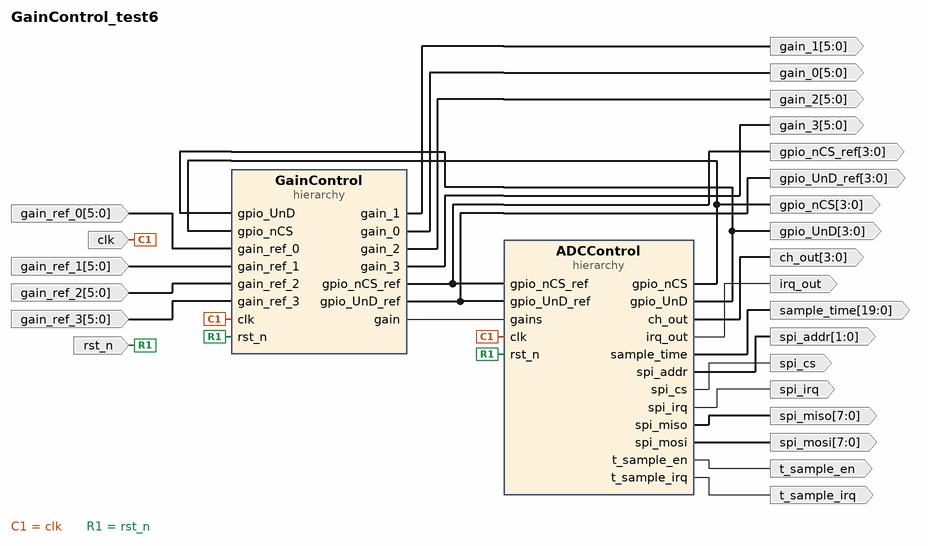
[diagram p0: block diagram of the top level]
# Vivado block design GainControl_test6, xczu3eg-sbva484-1-i, Vivado 2020.2
create_bd_design GainControl_test6

create_bd_port -dir O -from 3 -to 0 ch_out
create_bd_port -dir I -type clk clk
create_bd_port -dir O -from 5 -to 0 gain_0
create_bd_port -dir O -from 5 -to 0 gain_1
create_bd_port -dir O -from 5 -to 0 gain_2
create_bd_port -dir O -from 5 -to 0 gain_3
create_bd_port -dir I -from 5 -to 0 gain_ref_0
create_bd_port -dir I -from 5 -to 0 gain_ref_1
create_bd_port -dir I -from 5 -to 0 gain_ref_2
create_bd_port -dir I -from 5 -to 0 gain_ref_3
create_bd_port -dir O -from 3 -to 0 gpio_UnD
create_bd_port -dir O -from 3 -to 0 gpio_UnD_ref
create_bd_port -dir O -from 3 -to 0 gpio_nCS
create_bd_port -dir O -from 3 -to 0 gpio_nCS_ref
create_bd_port -dir O irq_out
create_bd_port -dir I -type rst rst_n
create_bd_port -dir O -from 19 -to 0 sample_time
create_bd_port -dir O -from 1 -to 0 spi_addr
create_bd_port -dir O spi_cs
create_bd_port -dir O spi_irq
create_bd_port -dir O -from 7 -to 0 spi_miso
create_bd_port -dir O -from 7 -to 0 -type data spi_mosi
create_bd_port -dir O t_sample_en
create_bd_port -dir O t_sample_irq

create_bd_cell -type hier ADCControl
create_bd_cell -type hier GainControl

# ---- hierarchy /ADCControl ----
current_bd_instance /ADCControl
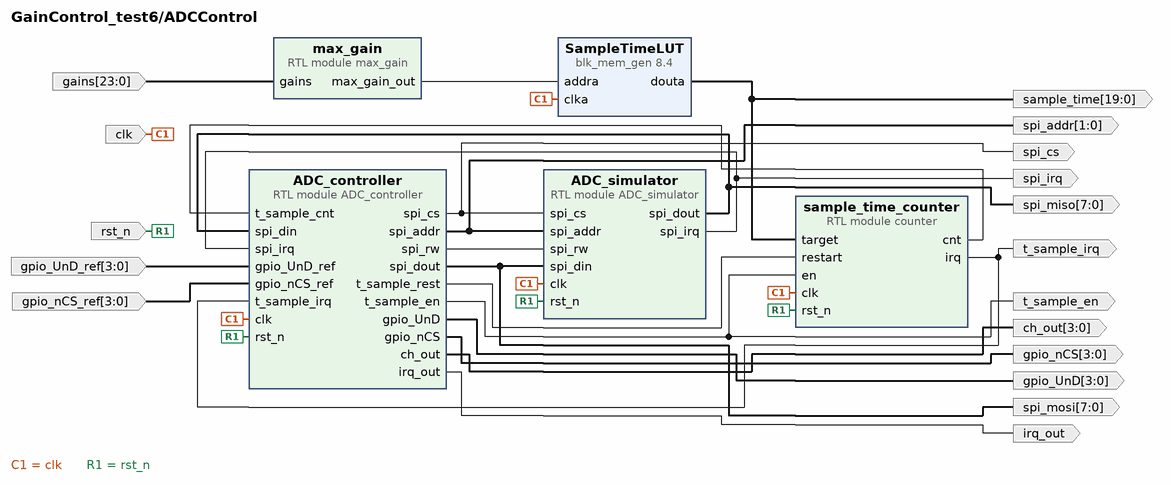
[diagram p1: block diagram inside /ADCControl]
create_bd_pin -dir I -type clk clk
create_bd_pin -dir I -type rst rst_n
create_bd_pin -dir O spi_cs
create_bd_pin -dir O -from 1 -to 0 spi_addr
create_bd_pin -dir O -from 7 -to 0 spi_mosi
create_bd_pin -dir O -from 7 -to 0 spi_miso
create_bd_pin -dir O spi_irq
create_bd_pin -dir O -from 3 -to 0 gpio_UnD
create_bd_pin -dir I -from 3 -to 0 gpio_UnD_ref
create_bd_pin -dir O -from 3 -to 0 gpio_nCS
create_bd_pin -dir I -from 3 -to 0 gpio_nCS_ref
create_bd_pin -dir O t_sample_en
create_bd_pin -dir O t_sample_irq
create_bd_pin -dir O -from 3 -to 0 ch_out
create_bd_pin -dir O irq_out
create_bd_pin -dir O -from 19 -to 0 sample_time
create_bd_pin -dir I -from 23 -to 0 gains

create_bd_cell -type module -reference ADC_controller ADC_controller
create_bd_cell -type module -reference ADC_simulator ADC_simulator
create_bd_cell -type module -reference counter sample_time_counter
set_property -dict {CONFIG.n_bits 20} [get_bd_cells sample_time_counter]
create_bd_cell -type module -reference max_gain max_gain
create_bd_cell -type ip -vlnv xilinx.com:ip:blk_mem_gen:8.4 SampleTimeLUT
set_property -dict [list \
  CONFIG.Coe_File ../../../../../../../../src/sample_time_lut_data.coe \
  CONFIG.Enable_32bit_Address false \
  CONFIG.Enable_A Always_Enabled \
  CONFIG.Fill_Remaining_Memory_Locations true \
  CONFIG.Load_Init_File true \
  CONFIG.Memory_Type Single_Port_ROM \
  CONFIG.Port_A_Write_Rate 0 \
  CONFIG.Register_PortA_Output_of_Memory_Primitives true \
  CONFIG.Remaining_Memory_Locations F \
  CONFIG.Use_RSTA_Pin false \
  CONFIG.Write_Depth_A 64 \
  CONFIG.Write_Width_A 20 \
  CONFIG.use_bram_block Stand_Alone \
] [get_bd_cells SampleTimeLUT]

# ---- hierarchy /GainControl ----
current_bd_instance /GainControl
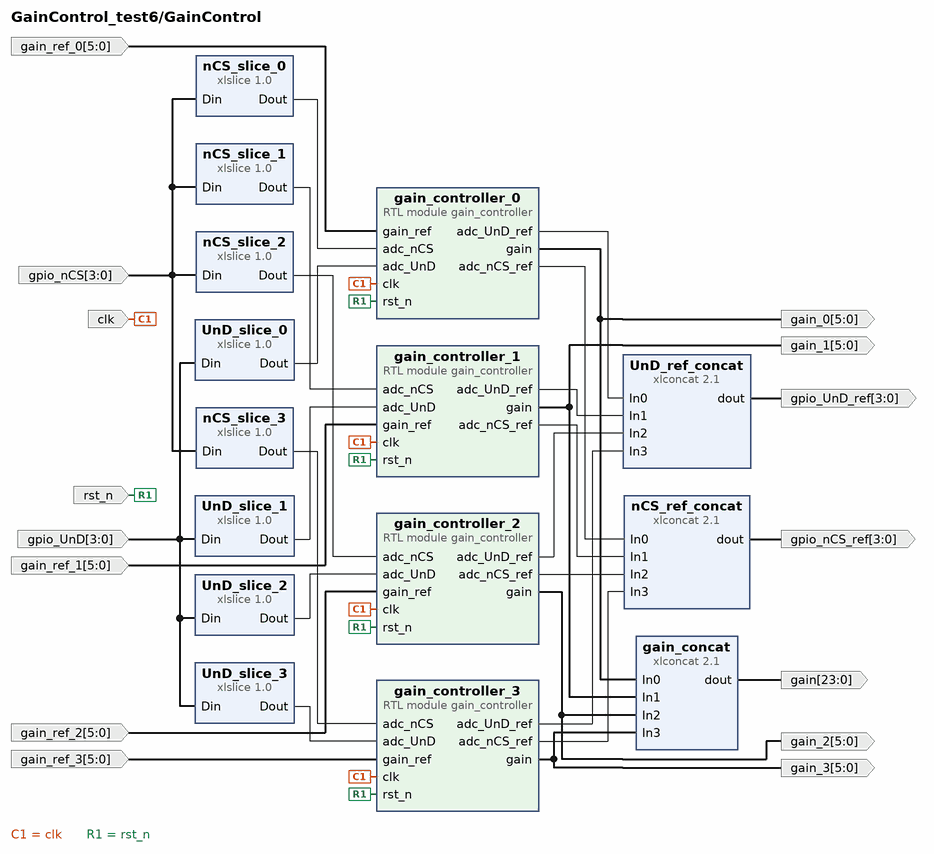
[diagram p2: block diagram inside /GainControl]
create_bd_pin -dir I -from 3 -to 0 gpio_nCS
create_bd_pin -dir I -from 3 -to 0 gpio_UnD
create_bd_pin -dir I -type clk clk
create_bd_pin -dir I -type rst rst_n
create_bd_pin -dir O -from 5 -to 0 gain_2
create_bd_pin -dir I -from 5 -to 0 gain_ref_2
create_bd_pin -dir O -from 5 -to 0 gain_3
create_bd_pin -dir I -from 5 -to 0 gain_ref_3
create_bd_pin -dir O -from 5 -to 0 gain_0
create_bd_pin -dir I -from 5 -to 0 gain_ref_0
create_bd_pin -dir O -from 5 -to 0 gain_1
create_bd_pin -dir I -from 5 -to 0 gain_ref_1
create_bd_pin -dir O -from 23 -to 0 gain
create_bd_pin -dir O -from 3 -to 0 gpio_nCS_ref
create_bd_pin -dir O -from 3 -to 0 gpio_UnD_ref

create_bd_cell -type ip -vlnv xilinx.com:ip:xlconcat:2.1 gain_concat
set_property -dict [list \
  CONFIG.IN0_WIDTH 6 \
  CONFIG.IN1_WIDTH 6 \
  CONFIG.IN2_WIDTH 6 \
  CONFIG.IN3_WIDTH 6 \
  CONFIG.NUM_PORTS 4 \
] [get_bd_cells gain_concat]
create_bd_cell -type ip -vlnv xilinx.com:ip:xlconcat:2.1 UnD_ref_concat
set_property -dict {CONFIG.NUM_PORTS 4} [get_bd_cells UnD_ref_concat]
create_bd_cell -type ip -vlnv xilinx.com:ip:xlconcat:2.1 nCS_ref_concat
set_property -dict {CONFIG.NUM_PORTS 4} [get_bd_cells nCS_ref_concat]
create_bd_cell -type ip -vlnv xilinx.com:ip:xlslice:1.0 UnD_slice_0
set_property -dict {CONFIG.DIN_WIDTH 4} [get_bd_cells UnD_slice_0]
create_bd_cell -type ip -vlnv xilinx.com:ip:xlslice:1.0 nCS_slice_0
set_property -dict {CONFIG.DIN_WIDTH 4} [get_bd_cells nCS_slice_0]
create_bd_cell -type module -reference gain_controller gain_controller_0
create_bd_cell -type ip -vlnv xilinx.com:ip:xlslice:1.0 UnD_slice_1
set_property -dict {CONFIG.DIN_FROM 1 CONFIG.DIN_TO 1 CONFIG.DIN_WIDTH 4 CONFIG.DOUT_WIDTH 1} [get_bd_cells UnD_slice_1]
create_bd_cell -type module -reference gain_controller gain_controller_1
create_bd_cell -type ip -vlnv xilinx.com:ip:xlslice:1.0 nCS_slice_1
set_property -dict {CONFIG.DIN_FROM 1 CONFIG.DIN_TO 1 CONFIG.DIN_WIDTH 4 CONFIG.DOUT_WIDTH 1} [get_bd_cells nCS_slice_1]
create_bd_cell -type ip -vlnv xilinx.com:ip:xlslice:1.0 UnD_slice_2
set_property -dict {CONFIG.DIN_FROM 2 CONFIG.DIN_TO 2 CONFIG.DIN_WIDTH 4 CONFIG.DOUT_WIDTH 1} [get_bd_cells UnD_slice_2]
create_bd_cell -type ip -vlnv xilinx.com:ip:xlslice:1.0 nCS_slice_2
set_property -dict {CONFIG.DIN_FROM 2 CONFIG.DIN_TO 2 CONFIG.DIN_WIDTH 4 CONFIG.DOUT_WIDTH 1} [get_bd_cells nCS_slice_2]
create_bd_cell -type module -reference gain_controller gain_controller_2
create_bd_cell -type ip -vlnv xilinx.com:ip:xlslice:1.0 UnD_slice_3
set_property -dict {CONFIG.DIN_FROM 3 CONFIG.DIN_TO 3 CONFIG.DIN_WIDTH 4 CONFIG.DOUT_WIDTH 1} [get_bd_cells UnD_slice_3]
create_bd_cell -type ip -vlnv xilinx.com:ip:xlslice:1.0 nCS_slice_3
set_property -dict {CONFIG.DIN_FROM 3 CONFIG.DIN_TO 3 CONFIG.DIN_WIDTH 4 CONFIG.DOUT_WIDTH 1} [get_bd_cells nCS_slice_3]
create_bd_cell -type module -reference gain_controller gain_controller_3

# ---- connections ----

current_bd_instance /ADCControl
connect_bd_net -net ADC_controller_0_spi_rw [get_bd_pins ADC_controller/spi_rw] [get_bd_pins ADC_simulator/spi_rw]
connect_bd_net [get_bd_pins ADC_controller/t_sample_rest] [get_bd_pins sample_time_counter/restart]
connect_bd_net [get_bd_pins sample_time_counter/cnt] [get_bd_pins ADC_controller/t_sample_cnt]
connect_bd_net -net max_gain_0_max_gain_out [get_bd_pins max_gain/max_gain_out] [get_bd_pins SampleTimeLUT/addra]
connect_bd_net -net clk_0_1 [get_bd_pins clk] \
  [get_bd_pins sample_time_counter/clk] [get_bd_pins SampleTimeLUT/clka] [get_bd_pins ADC_simulator/clk] \
  [get_bd_pins ADC_controller/clk]
connect_bd_net -net rst_n_0_1 [get_bd_pins rst_n] \
  [get_bd_pins sample_time_counter/rst_n] [get_bd_pins ADC_simulator/rst_n] [get_bd_pins ADC_controller/rst_n]
connect_bd_net -net ADC_controller_0_spi_cs [get_bd_pins ADC_controller/spi_cs] [get_bd_pins spi_cs] [get_bd_pins ADC_simulator/spi_cs]
connect_bd_net -net ADC_controller_0_spi_addr [get_bd_pins ADC_controller/spi_addr] [get_bd_pins spi_addr] [get_bd_pins ADC_simulator/spi_addr]
connect_bd_net -net ADC_controller_0_spi_dout [get_bd_pins ADC_controller/spi_dout] [get_bd_pins spi_mosi] [get_bd_pins ADC_simulator/spi_din]
connect_bd_net -net ADC_simulator_0_spi_dout1 [get_bd_pins ADC_simulator/spi_dout] [get_bd_pins spi_miso] [get_bd_pins ADC_controller/spi_din]
connect_bd_net -net ADC_simulator_0_spi_irq1 [get_bd_pins ADC_simulator/spi_irq] [get_bd_pins spi_irq] [get_bd_pins ADC_controller/spi_irq]
connect_bd_net -net ADC_controller_0_gpio_UnD [get_bd_pins ADC_controller/gpio_UnD] [get_bd_pins gpio_UnD]
connect_bd_net [get_bd_pins gpio_UnD_ref] [get_bd_pins ADC_controller/gpio_UnD_ref]
connect_bd_net -net ADC_controller_0_gpio_nCS [get_bd_pins ADC_controller/gpio_nCS] [get_bd_pins gpio_nCS]
connect_bd_net [get_bd_pins gpio_nCS_ref] [get_bd_pins ADC_controller/gpio_nCS_ref]
connect_bd_net [get_bd_pins ADC_controller/t_sample_en] [get_bd_pins t_sample_en] [get_bd_pins sample_time_counter/en]
connect_bd_net [get_bd_pins sample_time_counter/irq] [get_bd_pins t_sample_irq] [get_bd_pins ADC_controller/t_sample_irq]
connect_bd_net -net ADC_controller_0_ch_out [get_bd_pins ADC_controller/ch_out] [get_bd_pins ch_out]
connect_bd_net -net ADC_controller_0_irq_out [get_bd_pins ADC_controller/irq_out] [get_bd_pins irq_out]
connect_bd_net [get_bd_pins SampleTimeLUT/douta] [get_bd_pins sample_time] [get_bd_pins sample_time_counter/target]
connect_bd_net -net curr_gain_1 [get_bd_pins gains] [get_bd_pins max_gain/gains]

current_bd_instance /GainControl
connect_bd_net -net ADC_controller_0_gpio_nCS [get_bd_pins gpio_nCS] \
  [get_bd_pins nCS_slice_0/Din] [get_bd_pins nCS_slice_1/Din] [get_bd_pins nCS_slice_2/Din] [get_bd_pins nCS_slice_3/Din]
connect_bd_net -net ADC_controller_0_gpio_UnD [get_bd_pins gpio_UnD] \
  [get_bd_pins UnD_slice_0/Din] [get_bd_pins UnD_slice_1/Din] [get_bd_pins UnD_slice_2/Din] [get_bd_pins UnD_slice_3/Din]
connect_bd_net -net clk_0_1 [get_bd_pins clk] \
  [get_bd_pins gain_controller_0/clk] [get_bd_pins gain_controller_1/clk] [get_bd_pins gain_controller_2/clk] \
  [get_bd_pins gain_controller_3/clk]
connect_bd_net -net rst_n_0_1 [get_bd_pins rst_n] \
  [get_bd_pins gain_controller_0/rst_n] [get_bd_pins gain_controller_1/rst_n] [get_bd_pins gain_controller_2/rst_n] \
  [get_bd_pins gain_controller_3/rst_n]
connect_bd_net -net GainControl_2_gain [get_bd_pins gain_controller_2/gain] [get_bd_pins gain_2] [get_bd_pins gain_concat/In2]
connect_bd_net -net GainControl_3_gain [get_bd_pins gain_controller_3/gain] [get_bd_pins gain_3] [get_bd_pins gain_concat/In3]
connect_bd_net [get_bd_pins gain_controller_0/gain] [get_bd_pins gain_0] [get_bd_pins gain_concat/In0]
connect_bd_net -net GainControl_1_gain [get_bd_pins gain_controller_1/gain] [get_bd_pins gain_1] [get_bd_pins gain_concat/In1]
connect_bd_net [get_bd_pins gain_concat/dout] [get_bd_pins gain]
connect_bd_net [get_bd_pins nCS_ref_concat/dout] [get_bd_pins gpio_nCS_ref]
connect_bd_net [get_bd_pins UnD_ref_concat/dout] [get_bd_pins gpio_UnD_ref]
connect_bd_net -net gain_ref_0_1 [get_bd_pins gain_ref_0] [get_bd_pins gain_controller_0/gain_ref]
connect_bd_net [get_bd_pins UnD_slice_0/Dout] [get_bd_pins gain_controller_0/adc_UnD]
connect_bd_net [get_bd_pins gain_controller_0/adc_UnD_ref] [get_bd_pins UnD_ref_concat/In0]
connect_bd_net [get_bd_pins gain_controller_0/adc_nCS_ref] [get_bd_pins nCS_ref_concat/In0]
connect_bd_net [get_bd_pins nCS_slice_0/Dout] [get_bd_pins gain_controller_0/adc_nCS]
connect_bd_net -net UnD_slice_Dout [get_bd_pins UnD_slice_1/Dout] [get_bd_pins gain_controller_1/adc_UnD]
connect_bd_net -net nCS_slice_Dout [get_bd_pins nCS_slice_1/Dout] [get_bd_pins gain_controller_1/adc_nCS]
connect_bd_net -net gain_ref_1_1 [get_bd_pins gain_ref_1] [get_bd_pins gain_controller_1/gain_ref]
connect_bd_net [get_bd_pins gain_controller_1/adc_UnD_ref] [get_bd_pins UnD_ref_concat/In1]
connect_bd_net [get_bd_pins gain_controller_1/adc_nCS_ref] [get_bd_pins nCS_ref_concat/In1]
connect_bd_net -net UnD_slice_Dout_1 [get_bd_pins UnD_slice_2/Dout] [get_bd_pins gain_controller_2/adc_UnD]
connect_bd_net -net nCS_slice_Dout_1 [get_bd_pins nCS_slice_2/Dout] [get_bd_pins gain_controller_2/adc_nCS]
connect_bd_net [get_bd_pins gain_controller_2/adc_UnD_ref] [get_bd_pins UnD_ref_concat/In2]
connect_bd_net -net gain_ref_2_1 [get_bd_pins gain_ref_2] [get_bd_pins gain_controller_2/gain_ref]
connect_bd_net [get_bd_pins gain_controller_2/adc_nCS_ref] [get_bd_pins nCS_ref_concat/In2]
connect_bd_net -net UnD_slice_Dout_2 [get_bd_pins UnD_slice_3/Dout] [get_bd_pins gain_controller_3/adc_UnD]
connect_bd_net -net nCS_slice_Dout_2 [get_bd_pins nCS_slice_3/Dout] [get_bd_pins gain_controller_3/adc_nCS]
connect_bd_net -net gain_ref_3_1 [get_bd_pins gain_ref_3] [get_bd_pins gain_controller_3/gain_ref]
connect_bd_net [get_bd_pins gain_controller_3/adc_UnD_ref] [get_bd_pins UnD_ref_concat/In3]
connect_bd_net [get_bd_pins gain_controller_3/adc_nCS_ref] [get_bd_pins nCS_ref_concat/In3]

current_bd_instance /
connect_bd_net -net ADC_controller_0_ch_out [get_bd_pins ADCControl/ch_out] [get_bd_ports ch_out]
connect_bd_net -net ADC_controller_0_gpio_UnD [get_bd_pins ADCControl/gpio_UnD] [get_bd_ports gpio_UnD] [get_bd_pins GainControl/gpio_UnD]
connect_bd_net -net ADC_controller_0_gpio_nCS [get_bd_pins ADCControl/gpio_nCS] [get_bd_ports gpio_nCS] [get_bd_pins GainControl/gpio_nCS]
connect_bd_net -net ADC_controller_0_irq_out [get_bd_pins ADCControl/irq_out] [get_bd_ports irq_out]
connect_bd_net -net ADC_controller_0_spi_addr [get_bd_pins ADCControl/spi_addr] [get_bd_ports spi_addr]
connect_bd_net -net ADC_controller_0_spi_cs [get_bd_pins ADCControl/spi_cs] [get_bd_ports spi_cs]
connect_bd_net -net ADC_controller_0_spi_dout [get_bd_pins ADCControl/spi_mosi] [get_bd_ports spi_mosi]
connect_bd_net -net ADC_controller_t_sample_en [get_bd_pins ADCControl/t_sample_en] [get_bd_ports t_sample_en]
connect_bd_net -net ADC_simulator_0_spi_dout1 [get_bd_pins ADCControl/spi_miso] [get_bd_ports spi_miso]
connect_bd_net -net ADC_simulator_0_spi_irq1 [get_bd_pins ADCControl/spi_irq] [get_bd_ports spi_irq]
connect_bd_net -net GainControl_1_gain [get_bd_pins GainControl/gain_1] [get_bd_ports gain_1]
connect_bd_net -net GainControl_2_gain [get_bd_pins GainControl/gain_2] [get_bd_ports gain_2]
connect_bd_net -net GainControl_3_gain [get_bd_pins GainControl/gain_3] [get_bd_ports gain_3]
connect_bd_net -net SampleTimeLUT_douta [get_bd_pins ADCControl/sample_time] [get_bd_ports sample_time]
connect_bd_net -net clk_0_1 [get_bd_ports clk] [get_bd_pins ADCControl/clk] [get_bd_pins GainControl/clk]
connect_bd_net -net gain_controller_0_gain [get_bd_pins GainControl/gain_0] [get_bd_ports gain_0]
connect_bd_net -net gain_ref_0_1 [get_bd_ports gain_ref_0] [get_bd_pins GainControl/gain_ref_0]
connect_bd_net -net gain_ref_1_1 [get_bd_ports gain_ref_1] [get_bd_pins GainControl/gain_ref_1]
connect_bd_net -net gain_ref_2_1 [get_bd_ports gain_ref_2] [get_bd_pins GainControl/gain_ref_2]
connect_bd_net -net gain_ref_3_1 [get_bd_ports gain_ref_3] [get_bd_pins GainControl/gain_ref_3]
connect_bd_net -net gains_1 [get_bd_pins GainControl/gain] [get_bd_pins ADCControl/gains]
connect_bd_net -net gpio_UnD_ref_1 [get_bd_pins GainControl/gpio_UnD_ref] [get_bd_ports gpio_UnD_ref] [get_bd_pins ADCControl/gpio_UnD_ref]
connect_bd_net -net gpio_nCS_ref_1 [get_bd_pins GainControl/gpio_nCS_ref] [get_bd_ports gpio_nCS_ref] [get_bd_pins ADCControl/gpio_nCS_ref]
connect_bd_net -net rst_n_0_1 [get_bd_ports rst_n] [get_bd_pins ADCControl/rst_n] [get_bd_pins GainControl/rst_n]
connect_bd_net -net sample_time_counter_irq [get_bd_pins ADCControl/t_sample_irq] [get_bd_ports t_sample_irq]

validate_bd_design
save_bd_design
